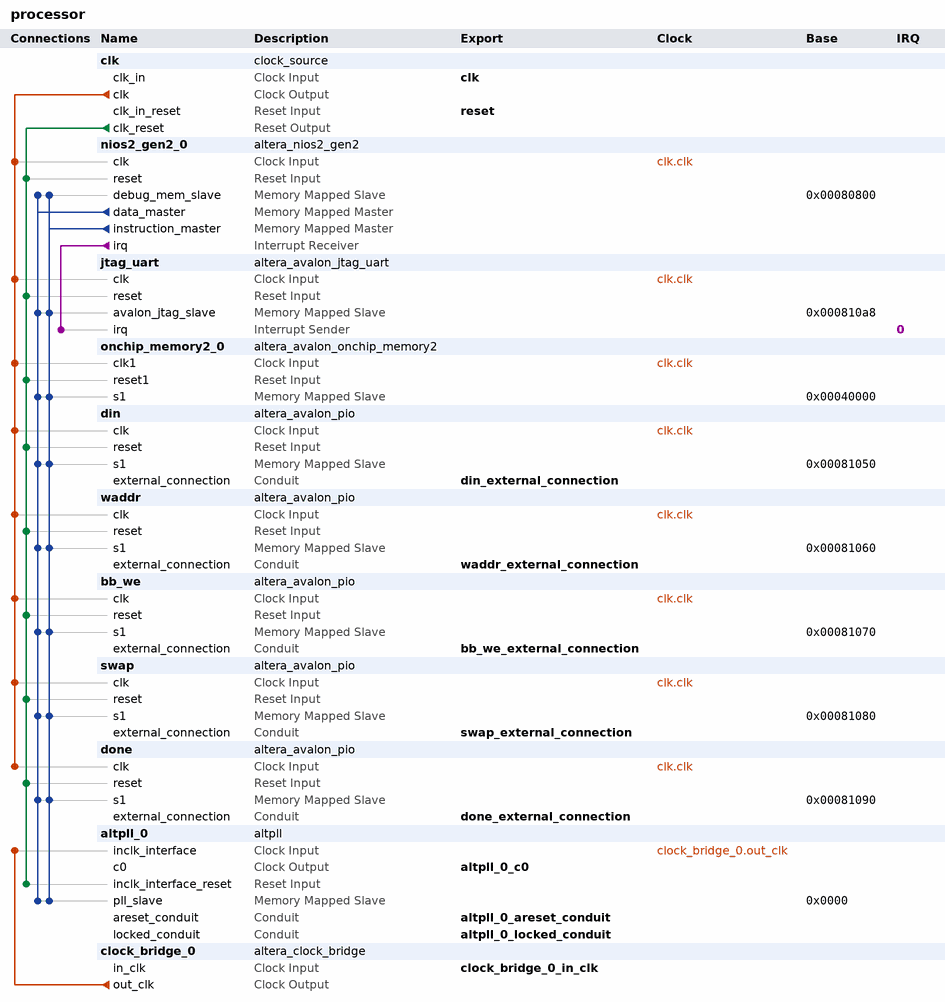
[diagram p0: system contents]
# Platform Designer (Qsys) system processor, Cyclone IV E EP4CE115F29C7
# Parameters at their usual value, and those the tool derives, are not listed.
package require -exact qsys 20.1
create_system processor
set_project_property DEVICE_FAMILY {Cyclone IV E}
set_project_property DEVICE EP4CE115F29C7

add_instance clk clock_source 20.1
set_instance_parameter_value clk clockFrequency 50000000

add_instance nios2_gen2_0 altera_nios2_gen2 20.1
set_instance_parameter_value nios2_gen2_0 dcache_size 2048
set_instance_parameter_value nios2_gen2_0 exceptionSlave onchip_memory2_0.s1
set_instance_parameter_value nios2_gen2_0 icache_size 4096
set_instance_parameter_value nios2_gen2_0 impl Fast
set_instance_parameter_value nios2_gen2_0 resetSlave onchip_memory2_0.s1

add_instance jtag_uart altera_avalon_jtag_uart 20.1
set_instance_parameter_value jtag_uart simInteractiveOptions NO_INTERACTIVE_WINDOWS

add_instance onchip_memory2_0 altera_avalon_onchip_memory2 20.1
set_instance_parameter_value onchip_memory2_0 dataWidth 32
set_instance_parameter_value onchip_memory2_0 dualPort false
set_instance_parameter_value onchip_memory2_0 initMemContent true
set_instance_parameter_value onchip_memory2_0 initializationFileName onchip_mem.hex
set_instance_parameter_value onchip_memory2_0 memorySize 200000

add_instance din altera_avalon_pio 20.1
set_instance_parameter_value din direction Output
set_instance_parameter_value din width 32

add_instance waddr altera_avalon_pio 20.1
set_instance_parameter_value waddr direction Output
set_instance_parameter_value waddr width 32

add_instance bb_we altera_avalon_pio 20.1
set_instance_parameter_value bb_we direction Output
set_instance_parameter_value bb_we width 1

add_instance swap altera_avalon_pio 20.1
set_instance_parameter_value swap direction Input
set_instance_parameter_value swap width 1

add_instance done altera_avalon_pio 20.1
set_instance_parameter_value done direction Output
set_instance_parameter_value done width 1

add_instance altpll_0 altpll 20.1
set_instance_parameter_value altpll_0 CLK0_DIVIDE_BY 1
set_instance_parameter_value altpll_0 CLK0_MULTIPLY_BY 1
set_instance_parameter_value altpll_0 INCLK0_INPUT_FREQUENCY 5000
set_instance_parameter_value altpll_0 PORT_ARESET PORT_USED
set_instance_parameter_value altpll_0 PORT_LOCKED PORT_USED
set_instance_parameter_value altpll_0 PORT_clk1 PORT_UNUSED
set_instance_parameter_value altpll_0 PORT_clk2 PORT_UNUSED
set_instance_parameter_value altpll_0 PORT_clk3 PORT_UNUSED

add_instance clock_bridge_0 altera_clock_bridge 20.1
set_instance_parameter_value clock_bridge_0 DERIVED_CLOCK_RATE 0
set_instance_parameter_value clock_bridge_0 EXPLICIT_CLOCK_RATE 0

# connections
add_connection clk.clk bb_we.clk clock
add_connection clk.clk din.clk clock
add_connection clk.clk done.clk clock
add_connection clk.clk jtag_uart.clk clock
add_connection clk.clk nios2_gen2_0.clk clock
add_connection clk.clk onchip_memory2_0.clk1 clock
add_connection clk.clk swap.clk clock
add_connection clk.clk waddr.clk clock
add_connection clock_bridge_0.out_clk altpll_0.inclk_interface clock
add_connection clk.clk_reset altpll_0.inclk_interface_reset reset
add_connection clk.clk_reset bb_we.reset reset
add_connection clk.clk_reset din.reset reset
add_connection clk.clk_reset done.reset reset
add_connection clk.clk_reset jtag_uart.reset reset
add_connection clk.clk_reset nios2_gen2_0.reset reset
add_connection clk.clk_reset onchip_memory2_0.reset1 reset
add_connection clk.clk_reset swap.reset reset
add_connection clk.clk_reset waddr.reset reset
add_connection nios2_gen2_0.data_master altpll_0.pll_slave avalon
set_connection_parameter_value nios2_gen2_0.data_master/altpll_0.pll_slave baseAddress 0x0000
add_connection nios2_gen2_0.data_master bb_we.s1 avalon
set_connection_parameter_value nios2_gen2_0.data_master/bb_we.s1 baseAddress 0x00081070
add_connection nios2_gen2_0.data_master din.s1 avalon
set_connection_parameter_value nios2_gen2_0.data_master/din.s1 baseAddress 0x00081050
add_connection nios2_gen2_0.data_master done.s1 avalon
set_connection_parameter_value nios2_gen2_0.data_master/done.s1 baseAddress 0x00081090
add_connection nios2_gen2_0.data_master jtag_uart.avalon_jtag_slave avalon
set_connection_parameter_value nios2_gen2_0.data_master/jtag_uart.avalon_jtag_slave baseAddress 0x000810a8
add_connection nios2_gen2_0.data_master nios2_gen2_0.debug_mem_slave avalon
set_connection_parameter_value nios2_gen2_0.data_master/nios2_gen2_0.debug_mem_slave baseAddress 0x00080800
add_connection nios2_gen2_0.data_master onchip_memory2_0.s1 avalon
set_connection_parameter_value nios2_gen2_0.data_master/onchip_memory2_0.s1 baseAddress 0x00040000
add_connection nios2_gen2_0.data_master swap.s1 avalon
set_connection_parameter_value nios2_gen2_0.data_master/swap.s1 baseAddress 0x00081080
add_connection nios2_gen2_0.data_master waddr.s1 avalon
set_connection_parameter_value nios2_gen2_0.data_master/waddr.s1 baseAddress 0x00081060
add_connection nios2_gen2_0.instruction_master altpll_0.pll_slave avalon
set_connection_parameter_value nios2_gen2_0.instruction_master/altpll_0.pll_slave baseAddress 0x0000
add_connection nios2_gen2_0.instruction_master bb_we.s1 avalon
set_connection_parameter_value nios2_gen2_0.instruction_master/bb_we.s1 baseAddress 0x00081070
add_connection nios2_gen2_0.instruction_master din.s1 avalon
set_connection_parameter_value nios2_gen2_0.instruction_master/din.s1 baseAddress 0x00081050
add_connection nios2_gen2_0.instruction_master done.s1 avalon
set_connection_parameter_value nios2_gen2_0.instruction_master/done.s1 baseAddress 0x00081090
add_connection nios2_gen2_0.instruction_master jtag_uart.avalon_jtag_slave avalon
set_connection_parameter_value nios2_gen2_0.instruction_master/jtag_uart.avalon_jtag_slave baseAddress 0x000810a8
add_connection nios2_gen2_0.instruction_master nios2_gen2_0.debug_mem_slave avalon
set_connection_parameter_value nios2_gen2_0.instruction_master/nios2_gen2_0.debug_mem_slave baseAddress 0x00080800
add_connection nios2_gen2_0.instruction_master onchip_memory2_0.s1 avalon
set_connection_parameter_value nios2_gen2_0.instruction_master/onchip_memory2_0.s1 baseAddress 0x00040000
add_connection nios2_gen2_0.instruction_master swap.s1 avalon
set_connection_parameter_value nios2_gen2_0.instruction_master/swap.s1 baseAddress 0x00081080
add_connection nios2_gen2_0.instruction_master waddr.s1 avalon
set_connection_parameter_value nios2_gen2_0.instruction_master/waddr.s1 baseAddress 0x00081060
add_connection nios2_gen2_0.irq jtag_uart.irq interrupt
set_connection_parameter_value nios2_gen2_0.irq/jtag_uart.irq irqNumber 0

# exported interfaces
add_interface altpll_0_areset_conduit conduit end
set_interface_property altpll_0_areset_conduit EXPORT_OF altpll_0.areset_conduit
add_interface altpll_0_c0 clock source
set_interface_property altpll_0_c0 EXPORT_OF altpll_0.c0
add_interface altpll_0_locked_conduit conduit end
set_interface_property altpll_0_locked_conduit EXPORT_OF altpll_0.locked_conduit
add_interface bb_we_external_connection conduit end
set_interface_property bb_we_external_connection EXPORT_OF bb_we.external_connection
add_interface clk clock sink
set_interface_property clk EXPORT_OF clk.clk_in
add_interface clock_bridge_0_in_clk clock sink
set_interface_property clock_bridge_0_in_clk EXPORT_OF clock_bridge_0.in_clk
add_interface din_external_connection conduit end
set_interface_property din_external_connection EXPORT_OF din.external_connection
add_interface done_external_connection conduit end
set_interface_property done_external_connection EXPORT_OF done.external_connection
add_interface reset reset sink
set_interface_property reset EXPORT_OF clk.clk_in_reset
add_interface swap_external_connection conduit end
set_interface_property swap_external_connection EXPORT_OF swap.external_connection
add_interface waddr_external_connection conduit end
set_interface_property waddr_external_connection EXPORT_OF waddr.external_connection

set_interconnect_requirement {$system} qsys_mm.clockCrossingAdapter HANDSHAKE
set_interconnect_requirement {$system} qsys_mm.enableEccProtection FALSE
set_interconnect_requirement {$system} qsys_mm.insertDefaultSlave FALSE
set_interconnect_requirement {$system} qsys_mm.maxAdditionalLatency 1

save_system processor.qsys
